# Altium schematic sheet CAN_interface.SchDoc
size Letter; DrawnBy: Robson Souza; SheetNumber: 2; SheetTotal: 9
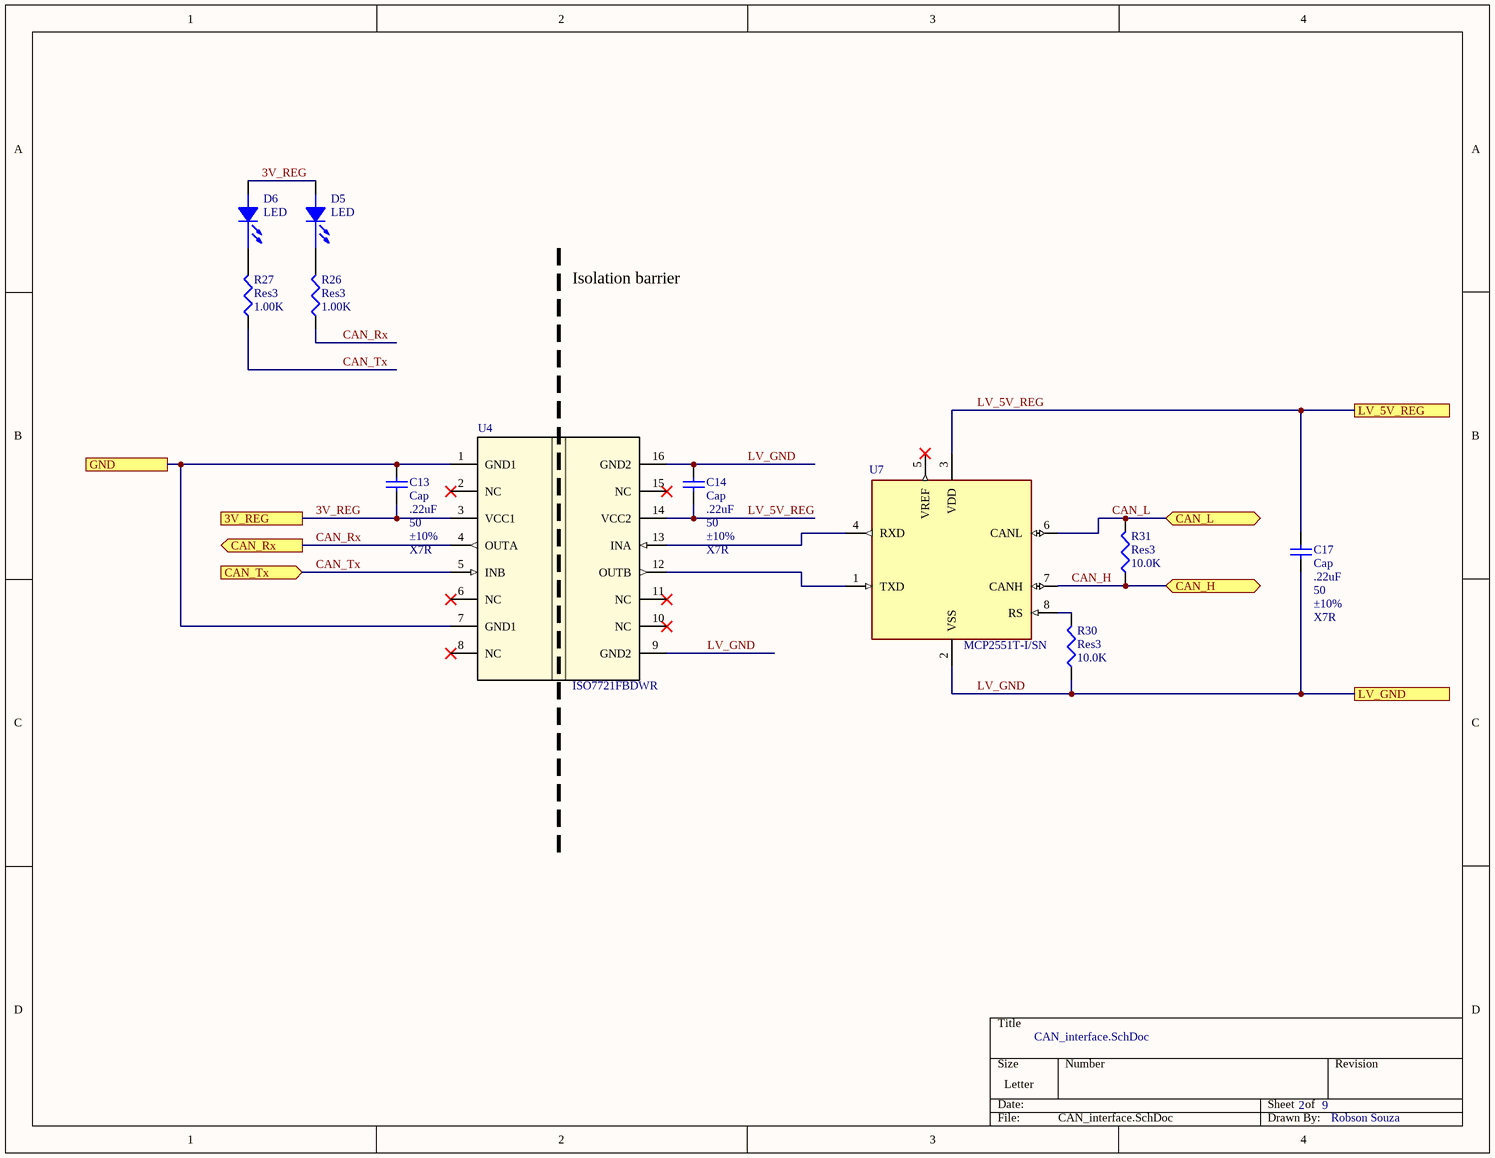
[diagram p0: CAN_interface.SchDoc]

## Parts
C13  Cap  value .22uF  WV: 50  Tolerance: ±10%  Type: X7R  [CAPC2012X09M]
C14  Cap  value .22uF  WV: 50  Tolerance: ±10%  Type: X7R  [CAPC2012X09M]
C17  Cap  value .22uF  WV: 50  Tolerance: ±10%  Type: X7R  [CAPC2012X09M]
D5  LED  [0603]
D6  LED  [0603]
R26  Res3  value 1.00K  [RESC2112X05M]
R27  Res3  value 1.00K  [RESC2112X05M]
R30  Res3  value 10.0K  [RESC2112X05M]
R31  Res3  value 10.0K  [RESC2112X05M]
U4  ISO7721FBDWR  [DW0016B_N]
U7  MCP2551T-I/SN  [SOIC127P600X175-8N]

## Ports
3V_REG, CAN_H (bidir), CAN_L (bidir), CAN_Rx (out), CAN_Tx (in), GND, LV_5V_REG, LV_GND

## Nets
3V_REG: C13.1 D5.1(A) D6.1(A) U4.3(VCC1) ; port 3V_REG
CAN_H: R31.1 U7.7(CANH) ; port CAN_H
CAN_L: R31.2 U7.6(CANL) ; port CAN_L
CAN_Rx: R26.1 U4.4(OUTA) ; port CAN_Rx
CAN_Tx: R27.1 U4.5(INB) ; port CAN_Tx
GND: C13.2 U4.1(GND1) U4.7(GND1) ; port GND
LV_5V_REG: C14.2 C17.1 U4.14(VCC2) U7.3(VDD) ; port LV_5V_REG
LV_GND: C14.1 C17.2 R30.1 U4.9(GND2) U4.16(GND2) U7.2(VSS) ; port LV_GND
NetD5_2: D5.2(C) R26.2
NetD6_2: D6.2(C) R27.2
NetR30_2: R30.2 U7.8(RS)
NetU4_12: U4.12(OUTB) U7.1(TXD)
NetU4_13: U4.13(INA) U7.4(RXD)

Not connected (* = marked no-connect by the designer): U4 2(NC)* 6(NC)* 8(NC)* 10(NC)* 11(NC)* 15(NC)*; U7 5(VREF)*

## Notes on the sheet
- Isolation barrier

## Library data of the parts
C13 C14 C17 = CAP-X7R-.22uF-50V-±10%: CAP CER .22uF 50v X7R 0805; MPN: C0805C224K5RACTU; PN: 399-3491-1-ND; Name: CAP-X7R-.22uF-50V-±10%; URL: http://www.digikey.ca/product-detail/en/C0805C224K5RACTU/399-3491-1-ND
D5 D6 = LED: pin to pad: 1>2 2>1
R26 R27 = Resistor_1.00K: RES SMD 1.00K OHM 1% 1/8W 0805; MPN: CRCW08051K00FKEA; PN: 541-1.00KCCT-ND; Name: Resistor_1.00K; URL: http://www.digikey.ca/product-detail/en/CRCW08051K00FKEA/541-1.00KCCT-ND
R30 R31 = Resistor_10.0K: RES SMD 10.0K OHM 1% 1/8W 0805; MPN: CRCW080510K0FKEA; PN: 541-10.0KCCT-ND; Name: Resistor_10.0K; URL: http://www.digikey.ca/product-detail/en/CRCW080510K0FKEA/541-10.0KCCT-ND
U4 = ISO7721FBDWR: Digital Isolador; Mfr_Name: Texas Instruments; Type: DEV; RefDes: RefDes; Copyright: Copyright (C) 2022 Ultra Librarian. All rights reserved.; Manufacturer_Part_Number: ISO7721FBDWR; Digi-Key_Part_Number_1: 296-ISO7721FBDWRTR-ND; Digi-Key_Part_Number_2: 296-ISO7721FBDWRCT-ND; Digi-Key_Part_Number_3: 296-ISO7721FBDWRDKR-ND
U7 = MCP2551T-I/SN: 1/1 Transceiver Half CANbus 8-SOIC; MF: Microchip; Availability: Unavailable; SnapEDA_Link: https://www.snapeda.com/parts/MCP2551T-I/SN/Microchip/view-part/1037590/?ref=snap; Price: None; Package: SO-8 Microchip; MP: MCP2551T-I/SN; Value: *